# EAGLE design PCB (EAGLE 9.6.2)
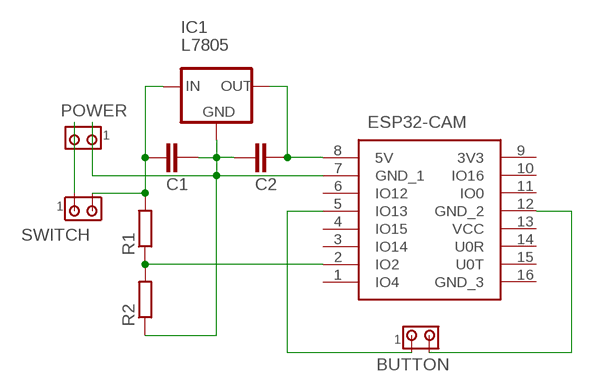
[diagram p0: schematic, sheet 1]

## Parts
BUTTON  MTA02-156  [1X2MTA]
C1  C2,5-3  [C2.5-3]
C2  C2,5-3  [C2.5-3]
IC1  L7805  [78XXS]
POWER  MTA02-156  [1X2MTA]
R1  R-EU_0207/15  [0207/15]
R2  R-EU_0207/15  [0207/15]
SWITCH  MTA02-156  [1X2MTA]
U$1  ESP32-CAM  [ESP32-CAM]

## Nets
N$1: BUTTON.2 U$1.12(GND_2)
N$2: BUTTON.1 U$1.5(IO13)
N$4: POWER.2 SWITCH.1
N$5: C1.2 C2.1 IC1.GND POWER.1 R2.1 U$1.7(GND_1)
N$6: C2.2 IC1.OUT U$1.8(5V)
N$7: C1.1 IC1.IN R1.2 SWITCH.2
N$8: R1.1 R2.2 U$1.2(IO2)
Unconnected: U$1.1(IO4) U$1.3(IO14) U$1.4(IO15) U$1.6(IO12) U$1.9(3V3) U$1.10(IO16) U$1.11(IO0) U$1.13(VCC) U$1.14(U0R) U$1.15(U0T) U$1.16(GND_3)

## Library data of the parts
BUTTON POWER SWITCH = con-amp:MTA02-156: AMP connector
C1 C2 = capacitor-wima:C: CAPACITOR naming: grid - package width
IC1 = L7805:L7805: ICP001 Check availability <https://pricing.snapeda.com/parts/L7805/STMicroelectronics/view-part?ref=eda>; AVAILABILITY: In Stock; DESCRIPTION: Standard Regulator Pos 5V 1.5A 3-Pin(3+Tab) TO-220FP Tube; MF: STMicroelectronics; MP: L7805; PACKAGE: None; PRICE: None; PURCHASE-URL: https://pricing.snapeda.com/search/part/L7805/?ref=eda
R1 R2 = rcl:R-EU_: RESISTOR, European symbol; SPICEPREFIX: R
U$1 = ESP32-CAM:ESP32-CAM: Modules PCBA Module RoHS Source: Datasheet <https://datasheet.lcsc.com/szlcsc/Ai-Thinker-ESP32-CAM_C277946.pdf> Check availability <https://pricing.snapeda.com/parts/ESP32-CAM/AI-Thinker/view-part?ref=eda>; AVAILABILITY: Not in stock; DESCRIPTION: ESP32 ESP32 Transceiver; 802.11 a/b/g/n (Wi-Fi, WiFi, WLAN), Bluetooth® Smart 4.x Low Energy (BLE) Evaluation Board; MF: AI-Thinker; MP: ESP32-CAM; PACKAGE: None; PRICE: None

## Board
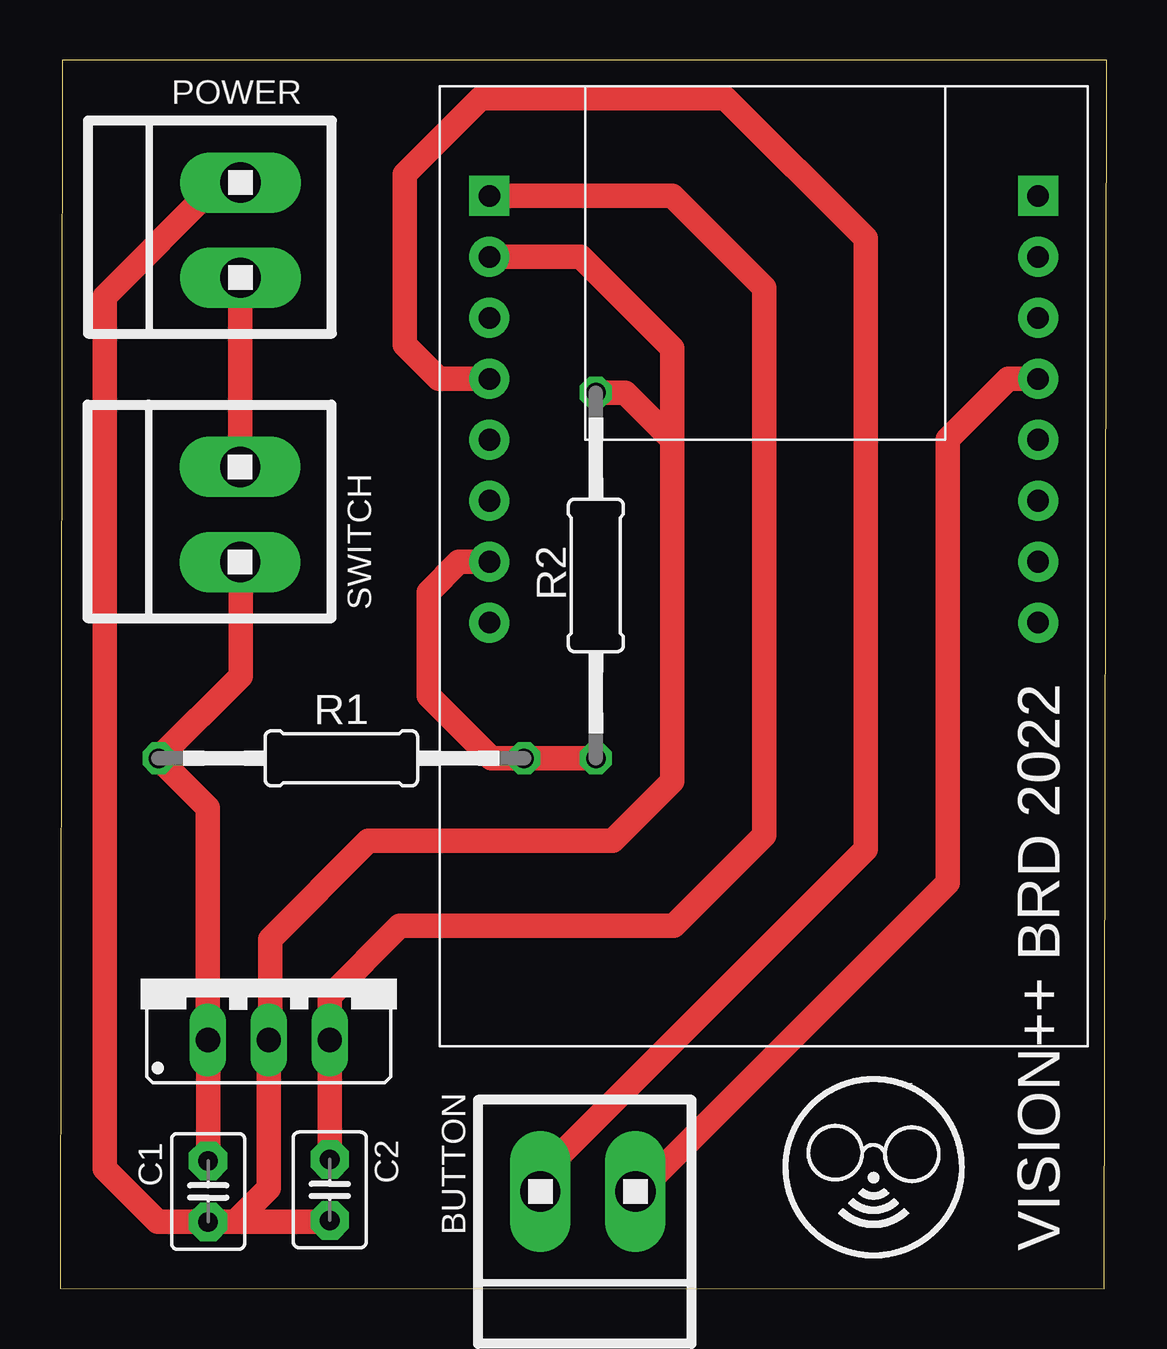
[diagram p1: board, top side]

Size 43.6 x 51.19 mm. Coordinates in mm from the lower left corner, seen from the top.
Outline: 0,0.01 43.5,0 43.6,51.18 0.1,51.19 0,0.01
Copper layers (1*16): Top 0.035mm / dielectric 1.5mm / Bottom 0.035mm
Design rules "default": minimum track width 6mil, minimum drill 0.35mm, track to track 6mil, track to pad 6mil, pad to pad 6mil, via to via 6mil, smd to smd 6mil, copper to edge 40mil, drill to drill 6mil, minimum pad ring 10mil, minimum via ring 8mil, stop-mask expansion 4mil, vias tented up to drill 0mil, thermal gap 10mil

### Footprints (pad centres in the part's own frame; a part is rotated, then mirrored left to right if it is on the bottom)
1X2MTA = drill 1.676 long: 1 1.981,0; 2 -1.981,0
C2.5-3 = drill 0.813 pad 1.6 octagon: 1 -1.27,0; 2 1.27,0
78XXS = drill 1.016 long: GND 0,-2.54; IN -2.54,-2.54; OUT 2.54,-2.54
0207/15 = drill 0.813 octagon: 1 -7.62,0; 2 7.62,0
ESP32-CAM = drill 0.9 pad 1.665: 1 0,0; 2 0,2.54; 3 0,5.08; 4 0,7.62; 5 0,10.16; 6 0,12.7; 7 0,15.24; 10 22.86,15.24; 11 22.86,12.7; 12 22.86,10.16; 13 22.86,7.62; 14 22.86,5.08; 15 22.86,2.54; 16 22.86,0 | drill 0.9 pad 1.665 square: 8 0,17.78; 9 22.86,17.78

### Placement (x,y rotation side)
BUTTON  22,4.05 180 top
C1  6.17,4.05 270 top
C2  11.24,4.11 90 top
IC1  8.7,12.9 0 top
POWER  7.52,44.11 90 top
R1  11.72,22.1 180 top
R2  22.33,29.72 270 top
SWITCH  7.51,32.26 90 top
U$1  17.89,27.75 0 top

### Tracks (layer width: path | path; a pad name or v marks a point on that pad's centre or on a via)
N$1
  Top 1.016: BUTTON.2 24.13,4.05 36.98,16.9 36.98,35.38 39.51,37.91 U$1.12
N$2
  Top 1.016: U$1.5 15.77,37.91 14.36,39.32 14.36,46.44 17.53,49.61 27.72,49.61 33.57,43.76 33.57,18.3 20.45,5.18 20.45,4.48 BUTTON.1
N$4
  Top 1.016: POWER.2 7.52,34.25 SWITCH.1
N$5
  Top 1.016: 25.51,35.37 25.51,39.18 21.7,42.99 U$1.7 | 25.51,35.37 25.51,21.15 23.03,18.66 12.85,18.66 8.75,14.55 8.75,10.41 IC1.GND 8.7,4.18 7.3,2.78 C1.2 | 25.51,35.37 23.55,37.34 R2.1 | POWER.1 6.6,46.09 1.85,41.34 1.85,4.99 4.06,2.78 C1.2 | C2.1 11.18,2.78 C1.2
N$6
  Top 1.016: U$1.8 25.51,45.53 29.35,41.69 29.35,18.88 25.58,15.11 14.16,15.11 11.24,12.19 IC1.OUT C2.2
N$7
  Top 1.016: SWITCH.2 7.51,30.2 7.53,30.23 7.53,25.53 R1.2 6.16,20.04 IC1.IN 6.17,10.35 C1.1
N$8
  Top 1.016: R2.2 R1.1 17.97,22.1 15.35,24.71 15.35,29.02 16.62,30.29 U$1.2

### Text on the board
tPlace: VISION++ BRD 2022